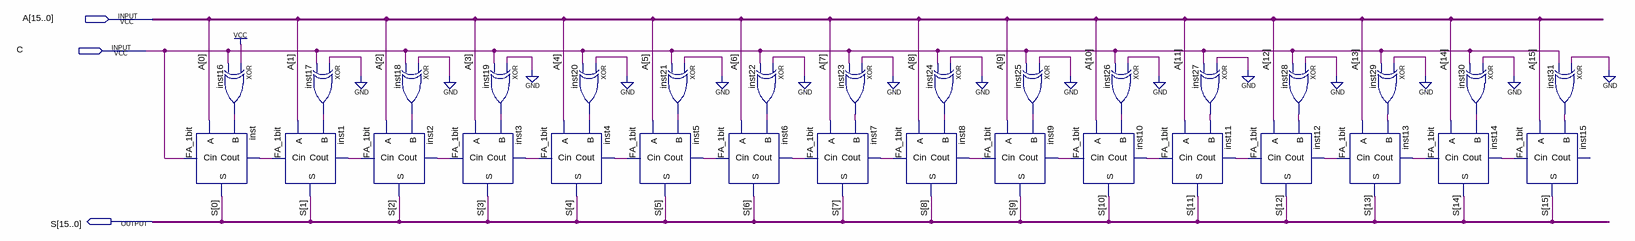
[diagram p0: schematic sheet]
// Quartus schematic ADD_SUB1_16BIT.bdf as structural Verilog: 32 symbols, 3 pins
module ADD_SUB1_16BIT (
  input  [15:0] A,
  input  C,
  output [15:0] S
);

  wire inst1_cout, inst2_cout, inst3_cout, inst4_cout, inst5_cout, inst6_cout, inst7_cout, inst8_cout,
       inst9_cout, inst10_cout, inst11_cout, inst12_cout, inst13_cout, inst14_cout, inst16_out, inst17_out,
       inst18_out, inst19_out, inst20_out, inst21_out, inst22_out, inst23_out, inst24_out, inst25_out,
       inst26_out, inst27_out, inst28_out, inst29_out, inst30_out, inst31_out, inst_cout;

  FA_1bit inst (.A(A[0]), .B(inst16_out), .Cin(C), .S(S[0]), .Cout(inst_cout));
  xor inst16 (inst16_out, 1'b1, C);
  FA_1bit inst1 (.A(A[1]), .B(inst17_out), .Cin(inst_cout), .S(S[1]), .Cout(inst1_cout));
  xor inst17 (inst17_out, 1'b0, C);
  FA_1bit inst2 (.A(A[2]), .B(inst18_out), .Cin(inst1_cout), .S(S[2]), .Cout(inst2_cout));
  xor inst18 (inst18_out, 1'b0, C);
  xor inst19 (inst19_out, 1'b0, C);
  FA_1bit inst3 (.A(A[3]), .B(inst19_out), .Cin(inst2_cout), .S(S[3]), .Cout(inst3_cout));
  FA_1bit inst4 (.A(A[4]), .B(inst20_out), .Cin(inst3_cout), .S(S[4]), .Cout(inst4_cout));
  xor inst20 (inst20_out, 1'b0, C);
  FA_1bit inst5 (.A(A[5]), .B(inst21_out), .Cin(inst4_cout), .S(S[5]), .Cout(inst5_cout));
  xor inst21 (inst21_out, 1'b0, C);
  FA_1bit inst6 (.A(A[6]), .B(inst22_out), .Cin(inst5_cout), .S(S[6]), .Cout(inst6_cout));
  xor inst22 (inst22_out, 1'b0, C);
  xor inst23 (inst23_out, 1'b0, C);
  FA_1bit inst7 (.A(A[7]), .B(inst23_out), .Cin(inst6_cout), .S(S[7]), .Cout(inst7_cout));
  FA_1bit inst8 (.A(A[8]), .B(inst24_out), .Cin(inst7_cout), .S(S[8]), .Cout(inst8_cout));
  xor inst24 (inst24_out, 1'b0, C);
  FA_1bit inst9 (.A(A[9]), .B(inst25_out), .Cin(inst8_cout), .S(S[9]), .Cout(inst9_cout));
  xor inst25 (inst25_out, 1'b0, C);
  FA_1bit inst10 (.A(A[10]), .B(inst26_out), .Cin(inst9_cout), .S(S[10]), .Cout(inst10_cout));
  xor inst26 (inst26_out, 1'b0, C);
  xor inst27 (inst27_out, 1'b0, C);
  FA_1bit inst11 (.A(A[11]), .B(inst27_out), .Cin(inst10_cout), .S(S[11]), .Cout(inst11_cout));
  FA_1bit inst12 (.A(A[12]), .B(inst28_out), .Cin(inst11_cout), .S(S[12]), .Cout(inst12_cout));
  xor inst28 (inst28_out, 1'b0, C);
  FA_1bit inst13 (.A(A[13]), .B(inst29_out), .Cin(inst12_cout), .S(S[13]), .Cout(inst13_cout));
  xor inst29 (inst29_out, 1'b0, C);
  FA_1bit inst14 (.A(A[14]), .B(inst30_out), .Cin(inst13_cout), .S(S[14]), .Cout(inst14_cout));
  xor inst30 (inst30_out, 1'b0, C);
  xor inst31 (inst31_out, 1'b0, C);
  FA_1bit inst15 (.A(A[15]), .B(inst31_out), .Cin(inst14_cout), .S(S[15]));  // open: Cout
endmodule
